# Altium schematic sheet 4_PowerSupplie.SchDoc
size 414 x 293 mm; SheetNumber: 4; SheetTotal: 4; PageSetup: Record=PageOptionsZCenterHorizontal=TrueZCenterVertical=TrueZPrintScale=1.00ZXCorrection=0.00ZYCorrection=0.00ZPrintKind=1ZBorderSize=5000000ZLeftOffset=0ZBottomOffset=0ZOrientation=2ZPaperLength=1000ZPaperWidth=1000ZScale=100ZPaperSource=7ZPrintQuality=-4ZMediaType=1ZDitherType=10ZPaperKind=A3ZPrintScaleMode=0; Razrabotal: {Разработал}; Proveril: {Проверил}; Tkontr: {Т.контр.}; Nkontr: {Н.контр.}; Ytverdil: {Утвердил}; Nazvanie1: {Название1}; Nazvanie2: {Название2}; Oboznachenie: {Обозначение}
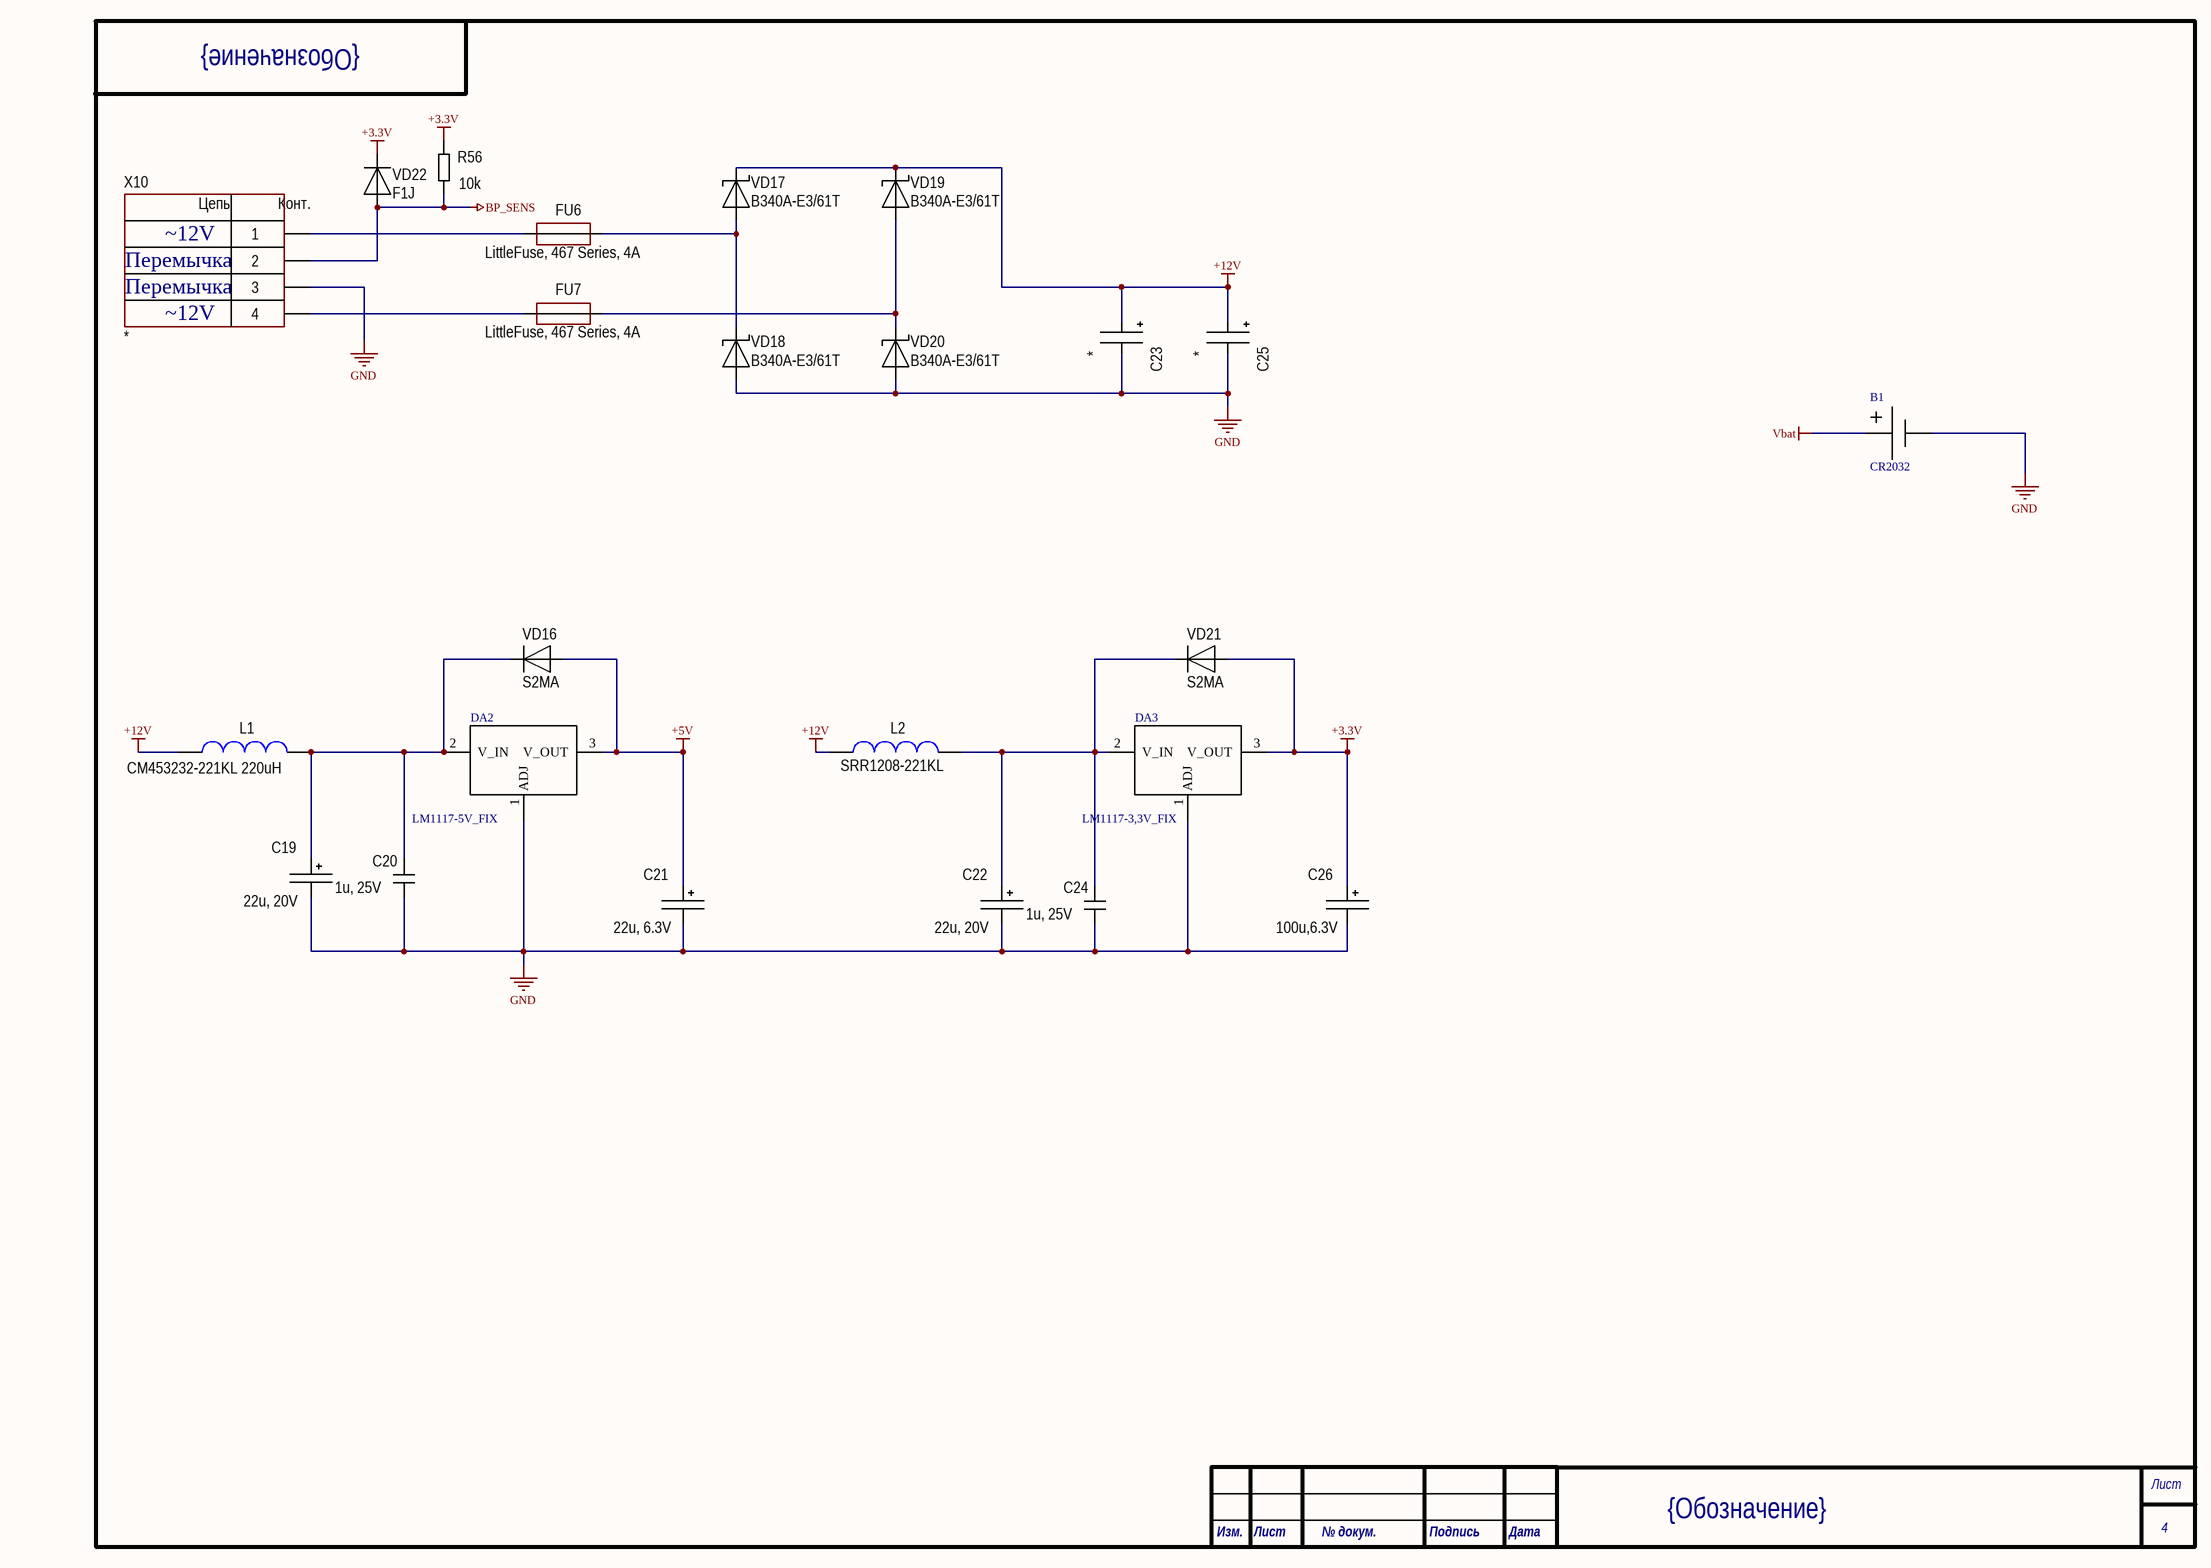
[diagram p0: 4_PowerSupplie.SchDoc]

## Parts
B1  CR2032  [CR2032]
C19  22u, 20V  [TANTAL_B]
C20  1u, 25V  [CH0805C]
C21  22u, 6.3V  [TANTAL_B]
C22  22u, 20V  [TANTAL_B]
C23  *  [D10C4.4H10]
C24  1u, 25V  [CH0805C]
C25  *  [D10C4.4H10]
C26  100u,6.3V  [TANTAL_B]
DA2  LM1117-5V_FIX  [SOT223_123]
DA3  LM1117-3,3V_FIX  [SOT223_123]
FU6  LittleFuse, 467 Series, 4A  [CH0603F]
FU7  LittleFuse, 467 Series, 4A  [CH0603F]
L1  CM453232-221KL 220uH  [IND:1812]
L2  SRR1208-221KL  [IND: SRR1208]
R56  10k  [CH0805R]
VD16  S2MA  [SMA]
VD17  B340A-E3/61T  [SMA]
VD18  B340A-E3/61T  [SMA]
VD19  B340A-E3/61T  [SMA]
VD20  B340A-E3/61T  [SMA]
VD21  S2MA  [SMA]
VD22  F1J  [SOD123F]
X10  *  [CON: CWF-4]

## Nets
+3.3V: C26.1 DA3.3(V_OUT) R56.2 VD21.1 VD22.2
+5V: C21.1 DA2.3(V_OUT) VD16.1
+12V: C23.1 C25.1 L1.2 L2.2 VD17.2 VD19.2
BP_SENS: R56.1 VD22.1 X10.2
GND: B1.2 C19.2 C20.1 C21.2 C22.2 C23.2 C24.1 C25.2 C26.2 DA2.1(ADJ) DA3.1(ADJ) VD18.1 VD20.1 X10.3
Vbat: B1.1
NetC19_1: C19.1 C20.2 DA2.2(V_IN) L1.1 VD16.2
NetC22_1: C22.1 C24.2 DA3.2(V_IN) L2.1 VD21.2
NetFU6_1: FU6.1 X10.1
NetFU6_2: FU6.2 VD17.1 VD18.2
NetFU7_1: FU7.1 X10.4
NetFU7_2: FU7.2 VD19.1 VD20.2

## Notes on the sheet
- Перемычка
- ~12V
- Лист
- Изм.
- № докум.
- Подпись
- Дата
- (in symbol 4-Connector) Цепь; Конт.

## Library data of the parts
B1 = Battery_CR2032
C19 C21 C22 C26 = TantalCap: Manufacturer: *; Model: *; HelpURL: *; ComponentKind: *; Value: *
C20 C24 = Capacitor: Manufacturer: *; Model: *; HelpURL: *; ComponentKind: *; Value: *
C23 C25 = AlumCap: Manufacturer: *; Model: *; HelpURL: *; ComponentKind: *; Value: *
DA2 DA3 = LM1117
FU6 FU7 = Fuse: Manufacturer: *; Model: *; HelpURL: *; ComponentKind: *; Value: *
L1 L2 = Inductor: Manufacturer: *; Model: *; HelpURL: *; ComponentKind: *; Value: *
R56 = Resistor: Manufacturer: *; Model: *; HelpURL: *; ComponentKind: *; Value: *
VD16 VD21 VD22 = Diod: ComponentKind: *; Manufacturer: *; Model: *; HelpURL: *
VD17-VD20 = Diod Schottky: ComponentKind: *; Manufacturer: *; Model: *; HelpURL: *
X10 = 4-Connector: Model: *; Manufacturer: *; HelpURL: *; ComponentKind: *